# Altium project microPower.PrjPCB
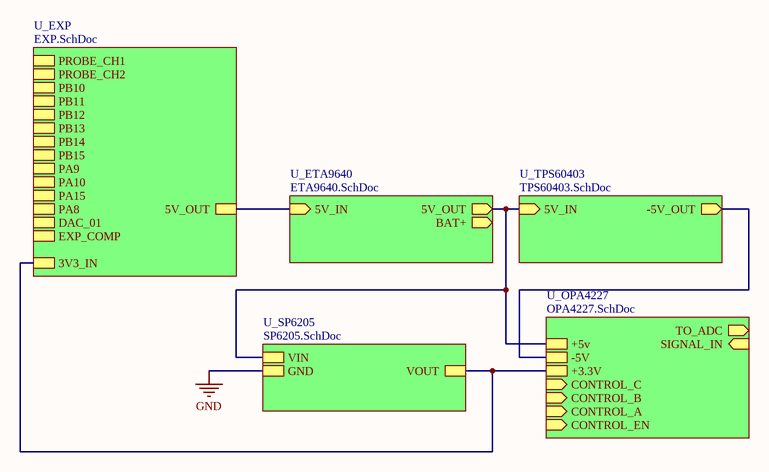
[diagram p0: MAIN.SchDoc]
6 sheets, 57 parts. Net scope: hierarchical (ports join the sheet entries above them; power ports are global).
Board file: microPower.PcbDoc
Sheets:
  MAIN.SchDoc
    U_EXP = EXP.SchDoc
    U_TPS60403 = TPS60403.SchDoc
    U_OPA4227 = OPA4227.SchDoc
    U_ETA9640 = ETA9640.SchDoc
    U_SP6205 = SP6205.SchDoc

## Sheet MAIN.SchDoc
size A4

### Sub-sheets
U_ETA9640 = ETA9640.SchDoc: 5V_IN (in), 5V_OUT (out), BAT+ (out)
U_EXP = EXP.SchDoc: PROBE_CH1, PROBE_CH2, PB10, PB11, PB12, PB13, PB14, PB15, PA9, PA10, PA15, PA8, DAC_01, EXP_COMP, 5V_OUT, 3V3_IN
U_OPA4227 = OPA4227.SchDoc: SIGNAL_IN (in), TO_ADC (out), +5v, -5V, +3.3V, CONTROL_C (in), CONTROL_B (in), CONTROL_A (in), CONTROL_EN (in)
U_SP6205 = SP6205.SchDoc: VIN, GND, VOUT
U_TPS60403 = TPS60403.SchDoc: 5V_IN (in), -5V_OUT (out)

### Nets
3.3V: sheet U_EXP/3V3_IN, sheet U_OPA4227/+3.3V, sheet U_SP6205/VOUT
5V: sheet U_TPS60403/5V_IN, sheet U_OPA4227/+5v, sheet U_ETA9640/5V_OUT, sheet U_SP6205/VIN
-5V: sheet U_TPS60403/-5V_OUT, sheet U_OPA4227/-5V
Net*1_1: sheet U_EXP/5V_OUT, sheet U_ETA9640/5V_IN

## Sheet EXP.SchDoc
size A4
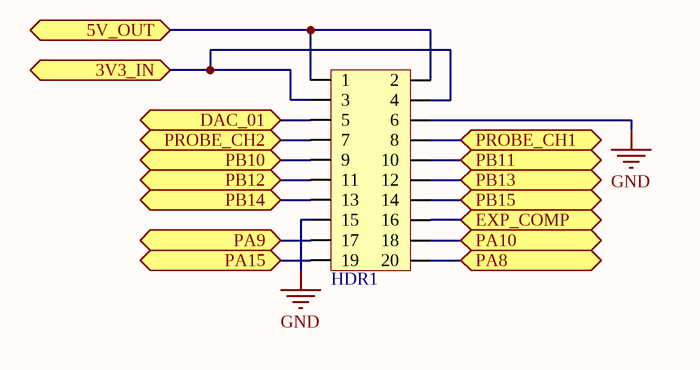
[diagram p1: EXP.SchDoc]

### Parts
HDR1  HDR2x10_2.54  [HDR2X10_2.54_180HF]  (value not drawn)

### Ports
3V3_IN, 5V_OUT, DAC_01, EXP_COMP, PA8, PA9, PA10, PA15, PB10, PB11, PB12, PB13, PB14, PB15, PROBE_CH1, PROBE_CH2

### Nets
3.3V: HDR1.3 HDR1.4 ; port 3V3_IN
GND: HDR1.6 HDR1.15
Net*1_1: HDR1.1 HDR1.2 ; port 5V_OUT
NetHDR1_5: HDR1.5 ; port DAC_01
NetHDR1_7: HDR1.7 ; port PROBE_CH2
NetHDR1_8: HDR1.8 ; port PROBE_CH1
NetHDR1_9: HDR1.9 ; port PB10
NetHDR1_10: HDR1.10 ; port PB11
NetHDR1_11: HDR1.11 ; port PB12
NetHDR1_12: HDR1.12 ; port PB13
NetHDR1_13: HDR1.13 ; port PB14
NetHDR1_14: HDR1.14 ; port PB15
NetHDR1_16: HDR1.16 ; port EXP_COMP
NetHDR1_17: HDR1.17 ; port PA9
NetHDR1_18: HDR1.18 ; port PA10
NetHDR1_19: HDR1.19 ; port PA15
NetHDR1_20: HDR1.20 ; port PA8

### Library data of the parts
HDR1 = HDR2x10_2.54: Header

## Sheet TPS60403.SchDoc
size A4
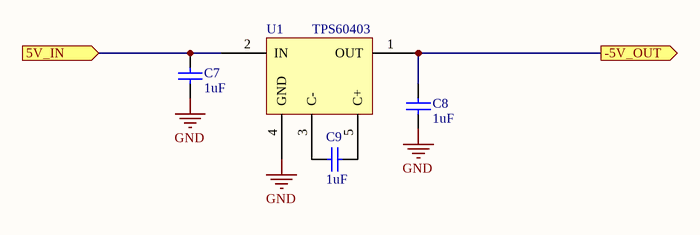
[diagram p2: TPS60403.SchDoc]

### Parts
C7  value 1uF  [CAP_0603]
C8  value 1uF  [CAP_0603]
C9  value 1uF  [CAP_0603]
U1  TPS60403  [SOT23-5]

### Ports
5V_IN (in), -5V_OUT (out)

### Nets
5V: C7.1 U1.2(IN) ; port 5V_IN
-5V: C8.1 U1.1(OUT) ; port -5V_OUT
GND: C7.2 C8.2 U1.4(GND)
NetC9_1: C9.1 U1.5(C+)
NetC9_2: C9.2 U1.3(C-)

### Library data of the parts
C7-C9 = Cap Semi: Capacitor (Semiconductor SIM Model); Published: 8-Jun-2000; LatestRevisionDate: 17-Jul-2002; LatestRevisionNote: Re-released for DXP Platform.; PackageReference: C1206; Publisher: Altium Limited
U1 = Component_1

## Sheet OPA4227.SchDoc
size A4
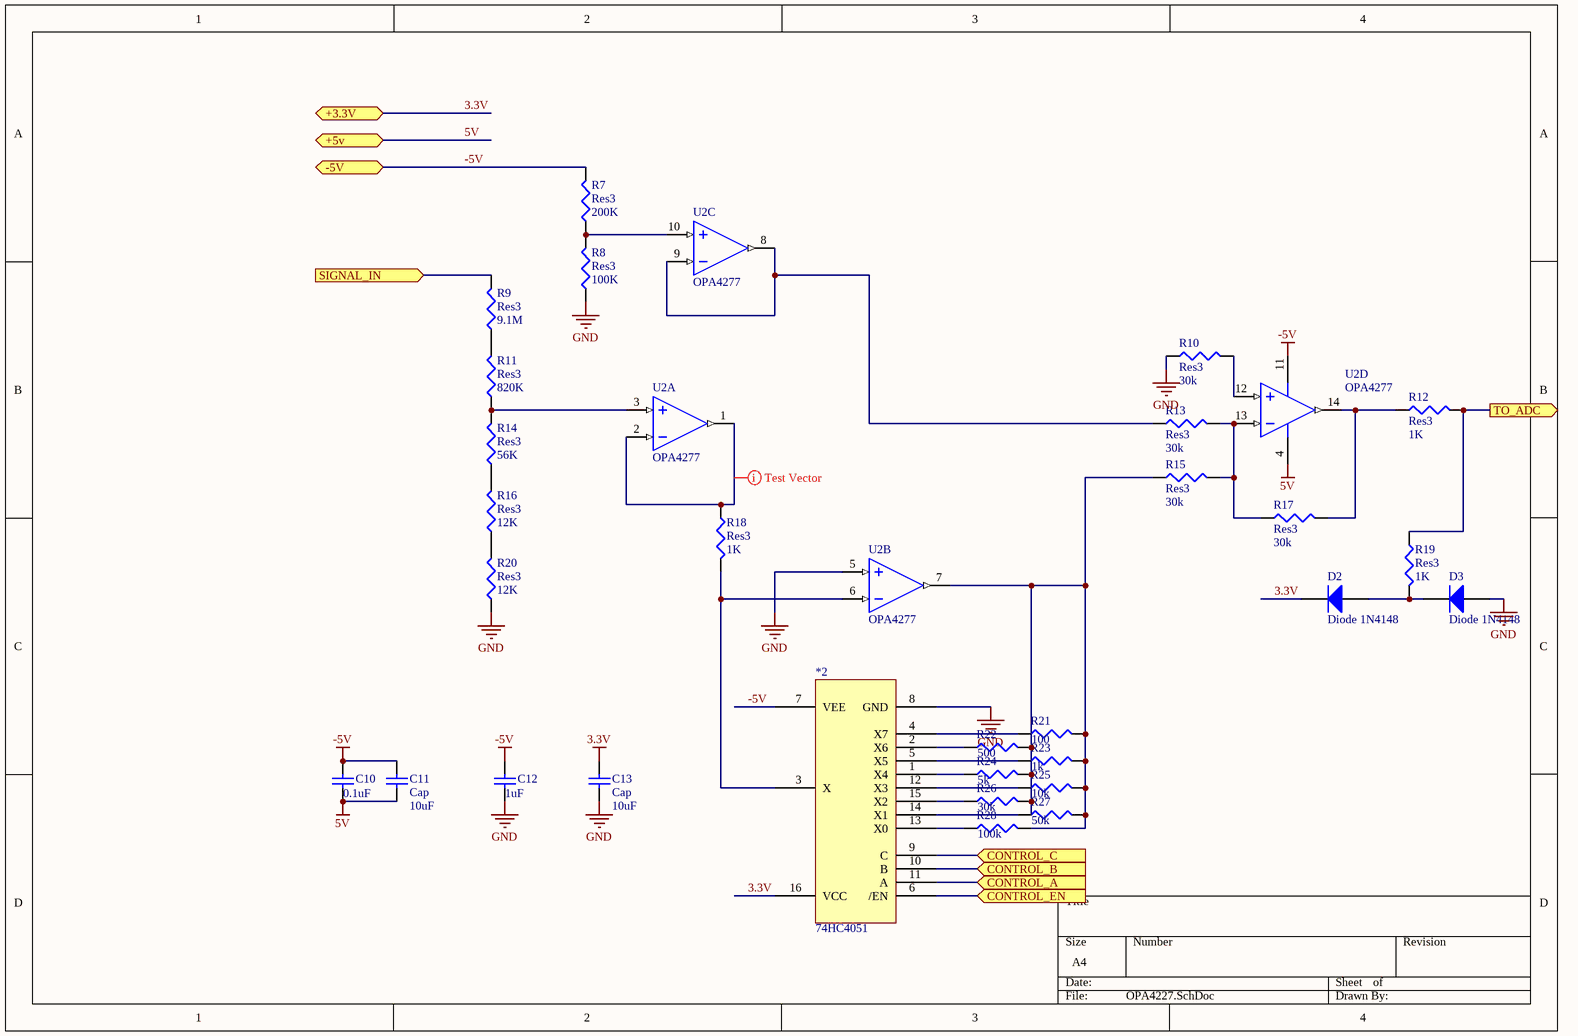
[diagram p3: OPA4227.SchDoc]

### Parts
*2  74HC4051  [SOP-16]
C10  value 0.1uF  [CAP_0603]  (hidden comment: Cap)
C11  Cap  value 10uF  [CAP_0603]
C12  value 1uF  [CAP_0603]  (hidden comment: Cap)
C13  Cap  value 10uF  [CAP_0603]
D2  Diode 1N4148  [DO-35]
D3  Diode 1N4148  [DO-35]
R7  Res3  value 200K  [RES_0603]
R8  Res3  value 100K  [RES_0603]
R9  Res3  value 9.1M  [RES_0603]
R10  Res3  value 30k  [RES_0603]
R11  Res3  value 820K  [RES_0603]
R12  Res3  value 1K  [RES_0603]
R13  Res3  value 30k  [RES_0603]
R14  Res3  value 56K  [RES_0603]
R15  Res3  value 30k  [RES_0603]
R16  Res3  value 12K  [RES_0603]
R17  Res3  value 30k  [RES_0603]
R18  Res3  value 1K  [RES_0603]
R19  Res3  value 1K  [RES_0603]
R20  Res3  value 12K  [RES_0603]
R21  value 100  [RES_0603]  (hidden comment: Res3)
R22  value 500  [RES_0603]  (hidden comment: Res3)
R23  value 1k  [RES_0603]  (hidden comment: Res3)
R24  value 5k  [RES_0603]  (hidden comment: Res3)
R25  value 10k  [RES_0603]  (hidden comment: Res3)
R26  value 30k  [RES_0603]  (hidden comment: Res3)
R27  value 50k  [RES_0603]  (hidden comment: Res3)
R28  value 100k  [RES_0603]  (hidden comment: Res3)
U2  OPA4277  [SO-14]  (parts A,B,C,D of 4)

### Ports
+3.3V, +5v, -5V, CONTROL_A (in), CONTROL_B (in), CONTROL_C (in), CONTROL_EN (in), SIGNAL_IN (in), TO_ADC (out)

### Nets
3.3V: *2.16(VCC) C13.2 D2.2(K) ; port +3.3V
5V: C10.1 C11.1 U2.4(V+) ; port +5v
-5V: *2.7(VEE) C10.2 C11.2 C12.2 R7.2 U2.11(V-) ; port -5V
GND: *2.8(GND) C12.1 C13.1 D3.1(A) R8.1 R10.1 R20.1 U2.5(IN+)
Net*2_1: *2.1(X4) R24.1
Net*2_2: *2.2(X6) R22.1
Net*2_3: *2.3(X) R18.2 U2.6(IN-)
Net*2_4: *2.4(X7) R21.1
Net*2_5: *2.5(X5) R23.1
Net*2_6: *2.6(/EN) ; port CONTROL_EN
Net*2_9: *2.9(C) ; port CONTROL_C
Net*2_10: *2.10(B) ; port CONTROL_B
Net*2_11: *2.11(A) ; port CONTROL_A
Net*2_12: *2.12(X3) R25.1
Net*2_13: *2.13(X0) R28.1
Net*2_14: *2.14(X1) R27.1
Net*2_15: *2.15(X2) R26.1
NetD2_1: D2.1(A) D3.2(K) R19.2
NetR7_1: R7.1 R8.2 U2.10(IN+)
NetR9_1: R9.1 R11.2
NetR9_2: R9.2 ; port SIGNAL_IN
NetR10_2: R10.2 U2.12(IN+)
NetR11_1: R11.1 R14.2 U2.3(IN+)
NetR12_1: R12.1 R17.2 U2.14(OUT)
NetR12_2: R12.2 R19.1 ; port TO_ADC
NetR13_1: R13.1 U2.8(OUT) U2.9(IN-)
NetR13_2: R13.2 R15.2 R17.1 U2.13(IN-)
NetR14_1: R14.1 R16.2
NetR15_1: R15.1 R21.2 R22.2 R23.2 R24.2 R25.2 R26.2 R27.2 R28.2 U2.7(OUT)
NetR16_1: R16.1 R20.2
NetR18_1: R18.1 U2.1(OUT) U2.2(IN-)

### Layout directives
Column: TestVectorIndex: NetR18_1

### Library data of the parts
C10-C13 = Cap: Capacitor; Published: 8-Jun-2000; LatestRevisionDate: 17-Jul-2002; LatestRevisionNote: Re-released for DXP Platform.; PackageReference: RAD-0.3; Publisher: Altium Limited
  C11 C13: PackageDescription: Radial Cap, Thru-Hole; 2 Leads; 0.3 in Pin Spacing
D2 D3 = Diode 1N4148: High Conductance Fast Diode; Published: 8-Jun-2000; LatestRevisionDate: 17-Jul-2002; LatestRevisionNote: Re-released for DXP Platform.; DatasheetVersion: 1997; PackageReference: DO-35; Publisher: Altium Limited; PackageDescription: Diode, Axial; Body 3.8 x 1.9 mm (LxDia. max), Lead Dia. 0.53 mm (max); Code_JEDEC: DO-204-AH; ComponentLink1Description: Manufacturer Link; ComponentLink1URL: http://www.fairchildsemi.com/; ComponentLink2Description: Datasheet; ComponentLink2URL: http://www.fairchildsemi.com/ds/1N%2F1N4148.pdf
R7-R28 = Res3: Resistor; Published: 8-Jun-2000; LatestRevisionDate: 29-May-2009; LatestRevisionNote: IPC-7351 Footprint Added.; PackageReference: J1-0603; Publisher: Altium Limited; PackageDescription: Chip Resistor
U2 = OPA4277: High Precision Operational Amplifiers; Text Field7: Published 8-Jun-2000

## Sheet ETA9640.SchDoc
size A4
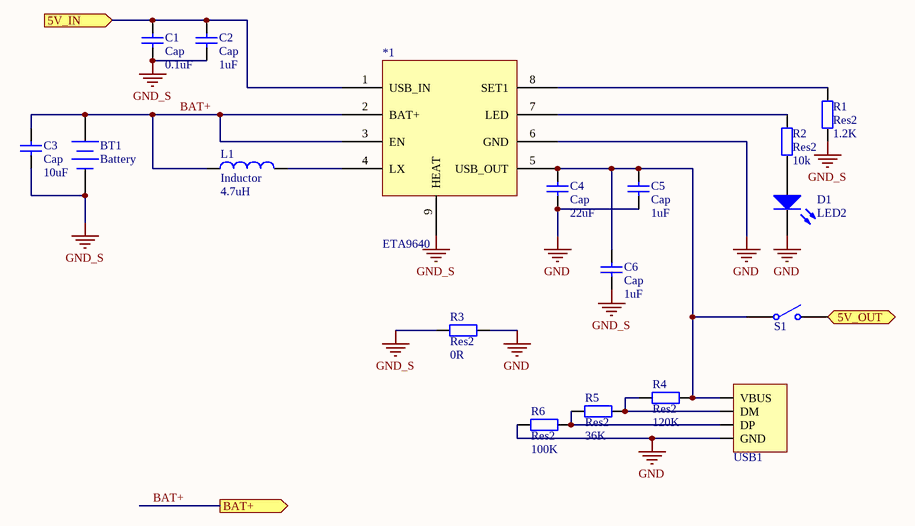
[diagram p4: ETA9640.SchDoc]

### Parts
*1  ETA9640  [ESOP-8]
BT1  Battery  [BAT-2]
C1  Cap  value 0.1uF  [CAP_0603]
C2  Cap  value 1uF  [CAP_0603]
C3  Cap  value 10uF  [1206]
C4  Cap  value 22uF  [1206]
C5  Cap  value 1uF  [CAP_0603]
C6  Cap  value 1uF  [CAP_0603]
D1  LED2  [LED_0603_RED]
L1  Inductor  value 4.7uH  [VLF4012_2R2]
R1  Res2  value 1.2K  [RES_0603]
R2  Res2  value 10k  [RES_0603]
R3  Res2  value 0R  [RES_0603]
R4  Res2  value 120K  [RES_0603]
R5  Res2  value 36K  [RES_0603]
R6  Res2  value 100K  [RES_0603]
S1  SW-SPST  [SB-4]  (value not drawn)
USB1  USB  [USB]  (value not drawn)

### Ports
5V_IN (in), 5V_OUT (out), BAT+ (out)

### Nets
5V: S1.2(NO) ; port 5V_OUT
GND: *1.6(GND) C4.1 C5.1 D1.2(K) R3.1 R6.1 USB1.-(GND)
GND_S: *1.9(HEAT) BT1.2(-) C1.1 C2.1 C3.1 C6.1 R1.1 R3.2
BAT+: *1.2(BAT+) *1.3(EN) BT1.1(+) C3.2 L1.1 ; port BAT+
Net*1_1: *1.1(USB_IN) C1.2 C2.2 ; port 5V_IN
Net*1_4: *1.4(LX) L1.2
Net*1_5: *1.5(USB_OUT) C4.2 C5.2 C6.2 R4.2 S1.1(COMMON) USB1.+(VBUS)
Net*1_7: *1.7(LED) R2.2
Net*1_8: *1.8(SET1) R1.2
NetD1_1: D1.1(A) R2.1
NetR4_1: R4.1 R5.2 USB1.DM
NetR5_1: R5.1 R6.2 USB1.DP

### Library data of the parts
BT1 = Battery: Multicell Battery; Published: 24-Mar-1999; LatestRevisionDate: 17-Jul-2002; LatestRevisionNote: Re-released for DXP Platform.; PackageReference: BAT-2; Publisher: Altium Limited
C1-C6 = Cap: Capacitor; Published: 8-Jun-2000; LatestRevisionDate: 17-Jul-2002; LatestRevisionNote: Re-released for DXP Platform.; PackageReference: RAD-0.3; Publisher: Altium Limited; PackageDescription: Radial Cap, Thru-Hole; 2 Leads; 0.3 in Pin Spacing
D1 = LED2: Typical RED, GREEN, YELLOW, AMBER GaAs LED; Published: 8-Jun-2000; LatestRevisionDate: 17-Jul-2002; LatestRevisionNote: Re-released for DXP Platform.; PackageVersion: Feb-2002; PackageReference: 3.2X1.6X1.1; Publisher: Altium Limited; PackageDescription: SM LED; 2 Flat Leads
L1 = Inductor: Code_IEC: 1005; Published: 8-Jun-2000; LatestRevisionDate: 29-May-2009; LatestRevisionNote: IPC-7351 Footprint Added.; PackageReference: 0402-A; Publisher: Altium Limited; PackageDescription: Chip Inductor; Code_JEITA: 0402
R1-R6 = Res2: Resistor; Published: 8-Jun-2000; LatestRevisionDate: 17-Jul-2002; LatestRevisionNote: Re-released for DXP Platform.; PackageReference: AXIAL-0.4; Publisher: Altium Limited; PackageDescription: Axial Device, Thru-Hole; 2 Leads; 0.4 in Pin Spacing
S1 = SW-SPST: Single-Pole, Single-Throw Switch; Published: 24-Mar-1999; LatestRevisionDate: 17-Jul-2002; LatestRevisionNote: Re-released for DXP Platform.; PackageReference: SPST-2; Publisher: Altium Limited

## Sheet SP6205.SchDoc
size A4
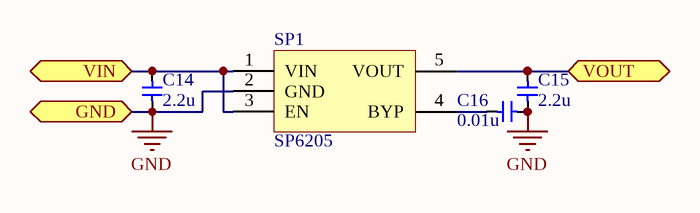
[diagram p5: SP6205.SchDoc]

### Parts
C14  value 2.2u  [CAP_0603]  (hidden comment: Cap_0603)
C15  value 2.2u  [CAP_0603]  (hidden comment: Cap_0603)
C16  value 0.01u  [CAP_0603]  (hidden comment: Cap_0603)
SP1  SP6205  [SOT23-5]

### Ports
GND, VIN, VOUT

### Nets
3.3V: C15.2 SP1.5(VOUT) ; port VOUT
5V: C14.2 SP1.1(VIN) SP1.3(EN) ; port VIN
GND: C14.1 C15.1 C16.1 SP1.2(GND) ; port GND
NetC16_2: C16.2 SP1.4(BYP)

### Library data of the parts
C14-C16 = Cap_0603: Capacitor
SP1 = SP6205: Power

## Nets that join several sheets
3.3V: EXP (HDR1.3 HDR1.4), OPA4227 (*2.16 C13.2 D2.2), SP6205 (C15.2 SP1.5)
5V: TPS60403 (C7.1 U1.2), OPA4227 (C10.1 C11.1 U2.4), ETA9640 (S1.2), SP6205 (C14.2 SP1.1 SP1.3)
-5V: TPS60403 (C8.1 U1.1), OPA4227 (6 pins)
GND: EXP (HDR1.6 HDR1.15), TPS60403 (C7.2 C8.2 U1.4), OPA4227 (8 pins), ETA9640 (7 pins), SP6205 (C14.1 C15.1 C16.1 SP1.2)
Net*1_1: EXP (HDR1.1 HDR1.2), ETA9640 (*1.1 C1.2 C2.2)